# EAGLE schematic Placa_intermediária (EAGLE 9.5.1)
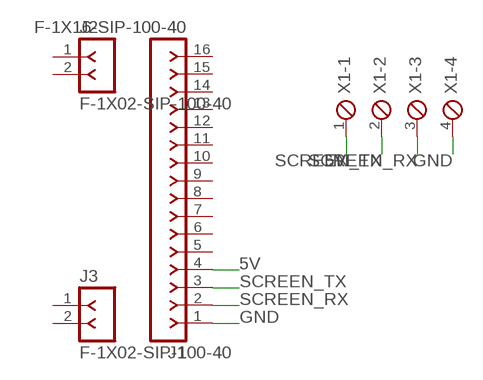
[diagram p0: schematic, sheet 1]

## Parts
J1  F-1X16-SIP-100-40  [SIP-100-16-40]
J2  F-1X02-SIP-100-40  [SIP-100-02-40]
J3  F-1X02-SIP-100-40  [SIP-100-02-40]
X1  MPT4  [4POL254]

## Nets
5V: J1.4 X1.1
GND: J1.1 X1.4
SCREEN_RX: J1.2 X1.3
SCREEN_TX: J1.3 X1.2
Unconnected: J1.5 J1.6 J1.7 J1.8 J1.9 J1.10 J1.11 J1.12 J1.13 J1.14 J1.15 J1.16 J2.1 J2.2 J3.1 J3.2

## Library data of the parts
J1 = con-headers-jp(1):F-1X16-: FEMALE HEADER
J2 J3 = con-headers-jp(1):F-1X02-: FEMALE HEADER
X1 = con-phoenix-254:MPT4: PHOENIX CONNECTOR; OC_FARNELL: unknown; OC_NEWARK: unknown